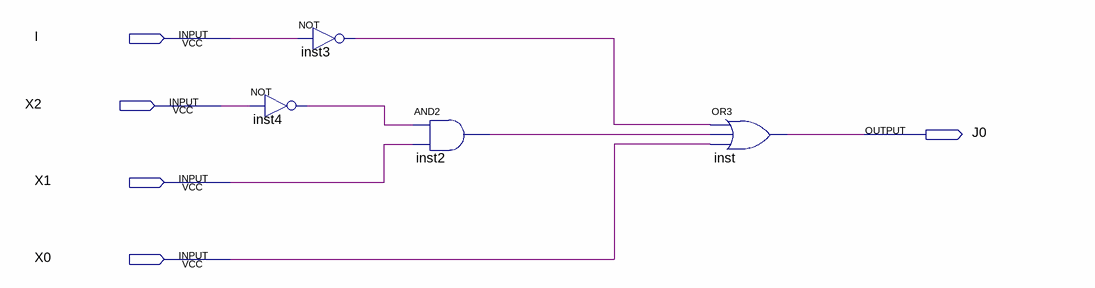
[diagram p0: schematic sheet]
// Quartus schematic J0.bdf as structural Verilog: 4 symbols, 5 pins
module J0 (
  input  I,
  input  X2,
  input  X1,
  input  X0,
  output J0
);

  wire inst2_out, inst3_out, inst4_out;

  not inst4 (inst4_out, X2);
  not inst3 (inst3_out, I);
  and inst2 (inst2_out, inst4_out, X1);
  or inst (J0, inst3_out, inst2_out, X0);
endmodule
